# EAGLE design hermes v2 (EAGLE 7.7.0)
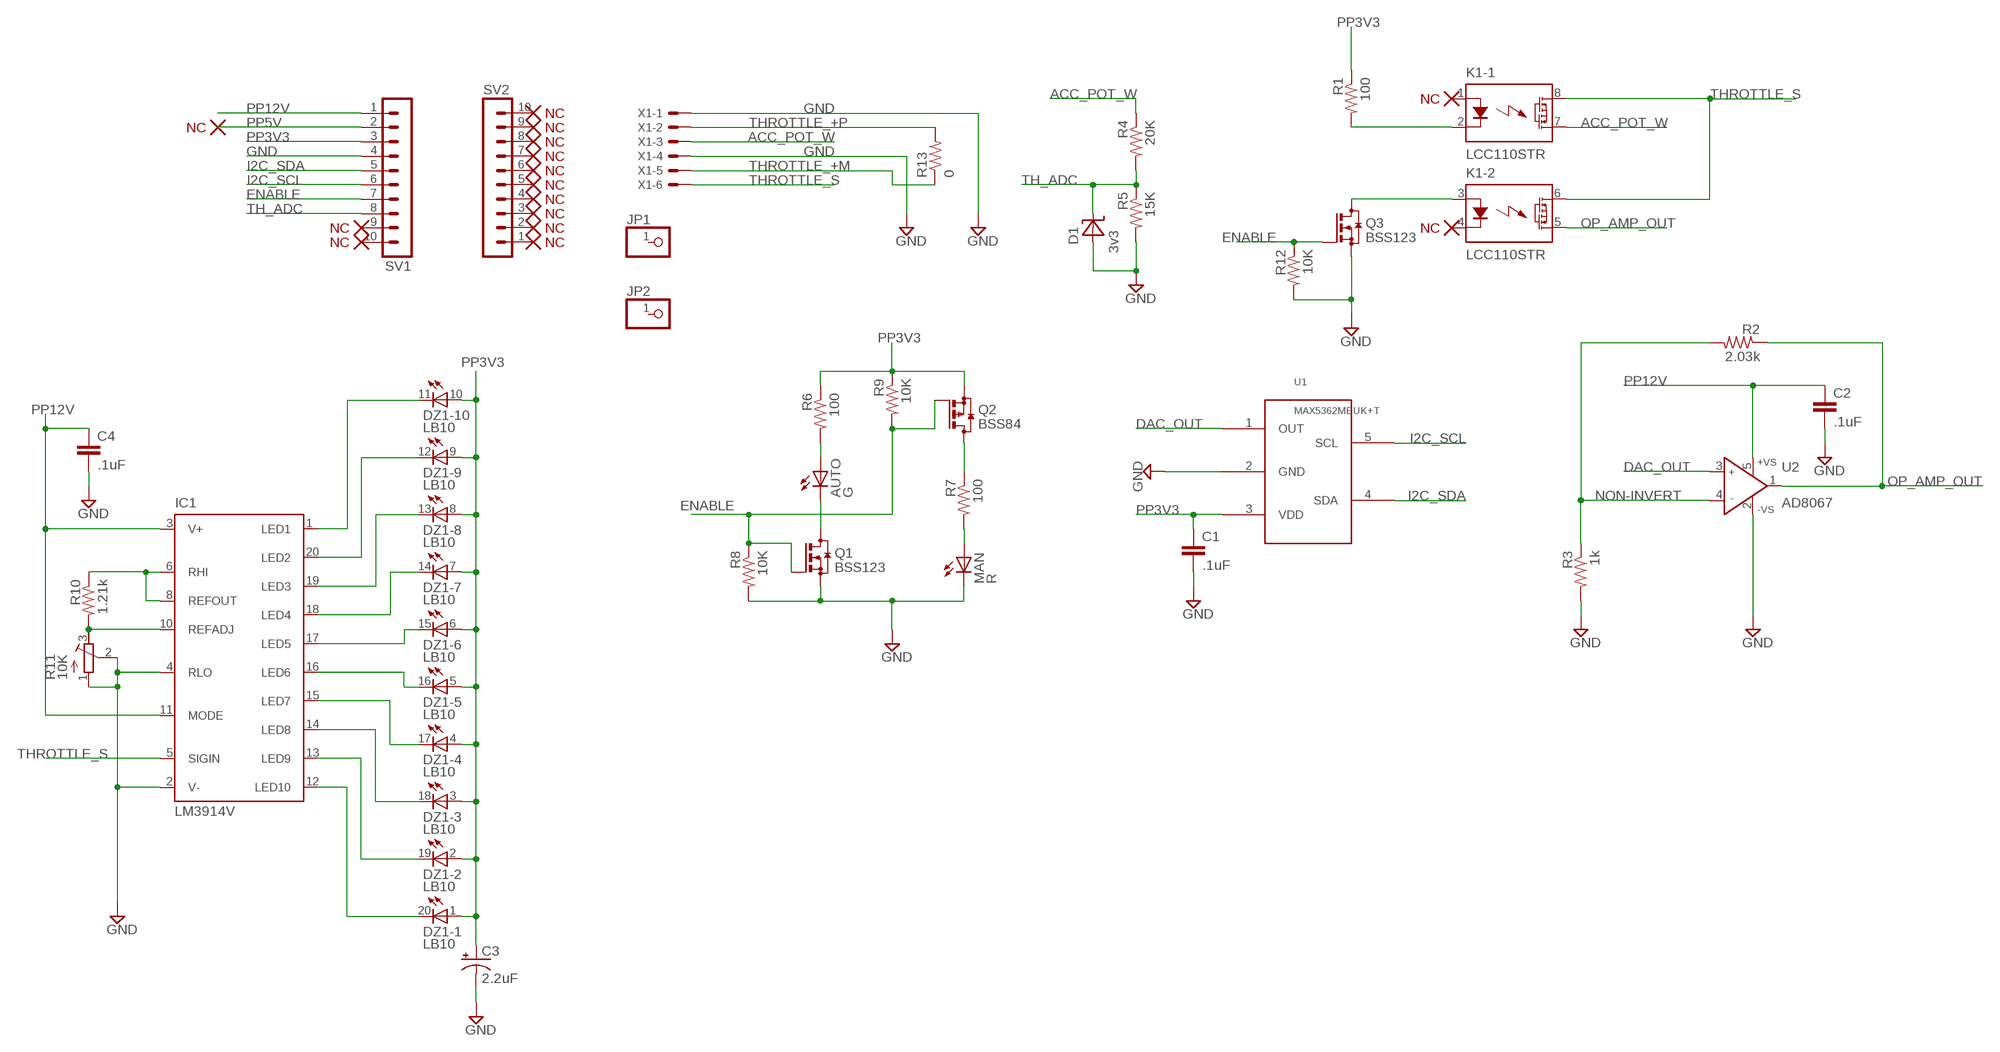
[diagram p0: schematic, sheet 1]

## Parts
AUTO  G  LED_ESML0603  [LED_SML0603]
C1  .1uF  CC0402  [C0402]
C2  .1uF  CC0402  [C0402]
C3  2.2uF  CPOL-USSMCA  [SMC_A]
C4  .1uF  CC0402  [C0402]
D1  3v3  ZENER  [SOD323_ST]
DZ1  LB10  [LB10]
IC1  LM3914V  [PLCC20S]
JP1  PINHD-1X1  [1X01]
JP2  PINHD-1X1  [1X01]
K1  LCC110STR  AQW654SMD  [DIL08SMD]
MAN  R  LED_ESML0603  [LED_SML0603]
Q1  BSS123  [SOT23]
Q2  BSS84  [SOT23]
Q3  BSS123  [SOT23]
R1  100  R-US_R0603  [R0603]
R2  2.03k  R-US_R0603  [R0603]
R3  1k  R-US_R0603  [R0603]
R4  20K  R-US_R0603  [R0603]
R5  15K  R-US_R0603  [R0603]
R6  100  R-US_R0603  [R0603]
R7  100  R-US_R0603  [R0603]
R8  10K  R-US_R0603  [R0603]
R9  10K  R-US_R0603  [R0603]
R10  1.21k  R-US_R0603  [R0603]
R11  10K  R-TRIMM5X  [RTRIM5X]
R12  10K  R-US_R0603  [R0603]
R13  0  R-US_R0402  [R0402]
SV1  MA10-1  [MA10-1]
SV2  MA10-1  [MA10-1]
U1  DAC  [SOT23-5]
U2  AD8067  [SOT23-5]
X1  22-23-2061  [22-23-2061]

## Nets
ACC_POT_W: K1.7(-1:D2) R4.1 X1.3
CONTROL_+: K1.2(-1:K) R1.2
CONTROL_-: K1.3(-2:A) Q3.3(D)
DAC_OUT: U1.1(OUT) U2.3(IN+)
ENABLE: Q1.1(G) Q2.1(G) Q3.1(G) R8.1 R9.2 R12.1 SV1.7
GND: C1.2 C2.2 C3.- C4.2 D1.A IC1.2(V-) IC1.4(RLO) MAN.C Q1.2(S) Q3.2(S) R3.2 R5.2 R8.2 R11.1(A) R11.2(S) R12.2 SV1.4 U1.2(GND) U2.2(-VS) X1.1 X1.4
I2C_SCL: SV1.6 U1.5(SCL)
I2C_SDA: SV1.5 U1.4(SDA)
N$1: DZ1.11(-10:C) IC1.1(LED1)
N$2: AUTO.C Q1.3(D)
N$3: MAN.A R7.2
N$4: AUTO.A R6.2
N$5: Q2.3(D) R7.1
N$6: DZ1.12(-9:C) IC1.20(LED2)
N$7: DZ1.13(-8:C) IC1.19(LED3)
N$8: DZ1.14(-7:C) IC1.18(LED4)
N$9: DZ1.15(-6:C) IC1.17(LED5)
N$10: DZ1.16(-5:C) IC1.16(LED6)
N$11: DZ1.17(-4:C) IC1.15(LED7)
N$12: DZ1.18(-3:C) IC1.14(LED8)
N$13: DZ1.19(-2:C) IC1.13(LED9)
N$14: DZ1.20(-1:C) IC1.12(LED10)
N$15: IC1.10(REFADJ) R10.2 R11.3(E)
N$16: IC1.6(RHI) IC1.8(REFOUT) R10.1
NON-INVERT: R2.2 R3.1 U2.4(IN-)
OP_AMP_OUT: K1.5(-2:D2) R2.1 U2.1(OUT)
PP3V3: C1.1 C3.+ DZ1.1(-1:A) DZ1.2(-2:A) DZ1.3(-3:A) DZ1.4(-4:A) DZ1.5(-5:A) DZ1.6(-6:A) DZ1.7(-7:A) DZ1.8(-8:A) DZ1.9(-9:A) DZ1.10(-10:A) Q2.2(S) R1.1 R6.1 R9.1 SV1.3 U1.3(VDD)
PP5V: SV1.2
PP12V: C2.1 C4.1 IC1.3(V+) IC1.11(MODE) SV1.1 U2.5(+VS)
TH_ADC: D1.C R4.2 R5.1 SV1.8
THROTTLE_+M: R13.1 X1.5
THROTTLE_+P: R13.2 X1.2
THROTTLE_S: IC1.5(SIGIN) K1.6(-2:D1) K1.8(-1:D1) X1.6
Unconnected: JP1.1 JP2.1 K1.1(-1:A) K1.4(-2:K) SV1.9 SV1.10 SV2.1 SV2.2 SV2.3 SV2.4 SV2.5 SV2.6 SV2.7 SV2.8 SV2.9 SV2.10

## Library data of the parts
AUTO MAN = eagle-ltspice:LED_E: LED Source: http://www.osram.convergy.de Source: www.luxeon.com Source: www.kingbright.com; SPICEMODEL: NONE; SPICEPREFIX: D; SPICETYPE: diode
C1 C2 C4 = eagle-ltspice:C: CAPACITOR, European symbol; SPICEMODEL: NONE; SPICEPREFIX: C
C3 = rcl:CPOL-US: POLARIZED CAPACITOR, American symbol; DIGI: 478-3119-2-ND
D1 = diode:ZENER
DZ1 = led:LB10: LED BLOCK 10-LED bar graph, DIL, Siemens
IC1 = national-semiconductor:LM391: Dot/Bar Display Driver Source: Data sheet LM3915 <http://www.national.com/ds/LM/LM3915.pdf> Data sheet LM3914 <http://www.national.com/ds/LM/LM3914.pdf>
JP1 JP2 = pinhead:PINHD-1X1: PIN HEADER
K1 = relay:AQW*: PhotoMOS Relay NAiS Source: http://www.mew-europe.com/.. pti_en.pdf; MF: AROMAT/ MATSUSHITA; MPN: AQW654; OC_FARNELL: unknown; OC_NEWARK: 98B6279
Q1 Q3 = transistor-small-signal:BSS123: N-CHANNEL MOS FET
Q2 = transistor-small-signal:BSS84: P-CHANNEL MOS FET
R1-R10 R12 = resistor:R-US_: RESISTOR, American symbol
R11 = rcl:R-TRIMM: Trimm resistor; DIGI: 490-2678-1-ND
R13 = rcl:R-US_: RESISTOR, American symbol
SV1 SV2 = con-lstb:MA10-1: PIN HEADER; OC_FARNELL: unknown; OC_NEWARK: unknown
U1 = DAC:DAC; DIGI: MAX5362MEUK+TCT-ND
U2 = analog-devices:AD8067: High Gain Bandwidth, Precision Fast FET(TM) Op Amp Source: http://www.analog.com/UploadedFiles/Data_Sheets/346131962AD8067_a.pdf; DIGI: 497-13051-1-ND; MF: ALTERA CORPORATION; MPN: AD8067ARTZ-REEL7; OC_FARNELL: 1464848; OC_NEWARK: 59K6326
X1 = con-molex:22-23-2061: .100" (2.54mm) Center Header - 6 Pin; MF: MOLEX; MPN: 22-23-2061; OC_FARNELL: 1462922; OC_NEWARK: 27C1933

## Board
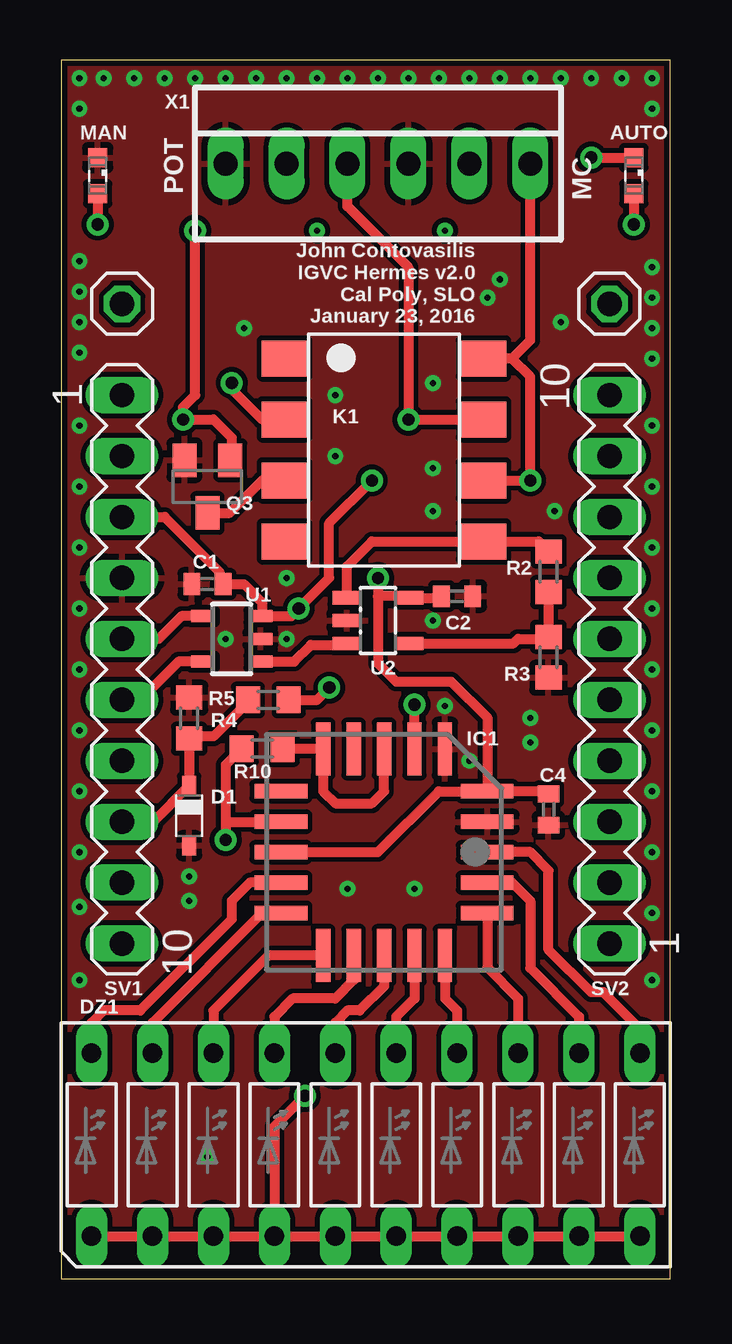
[diagram p1: board, top side]
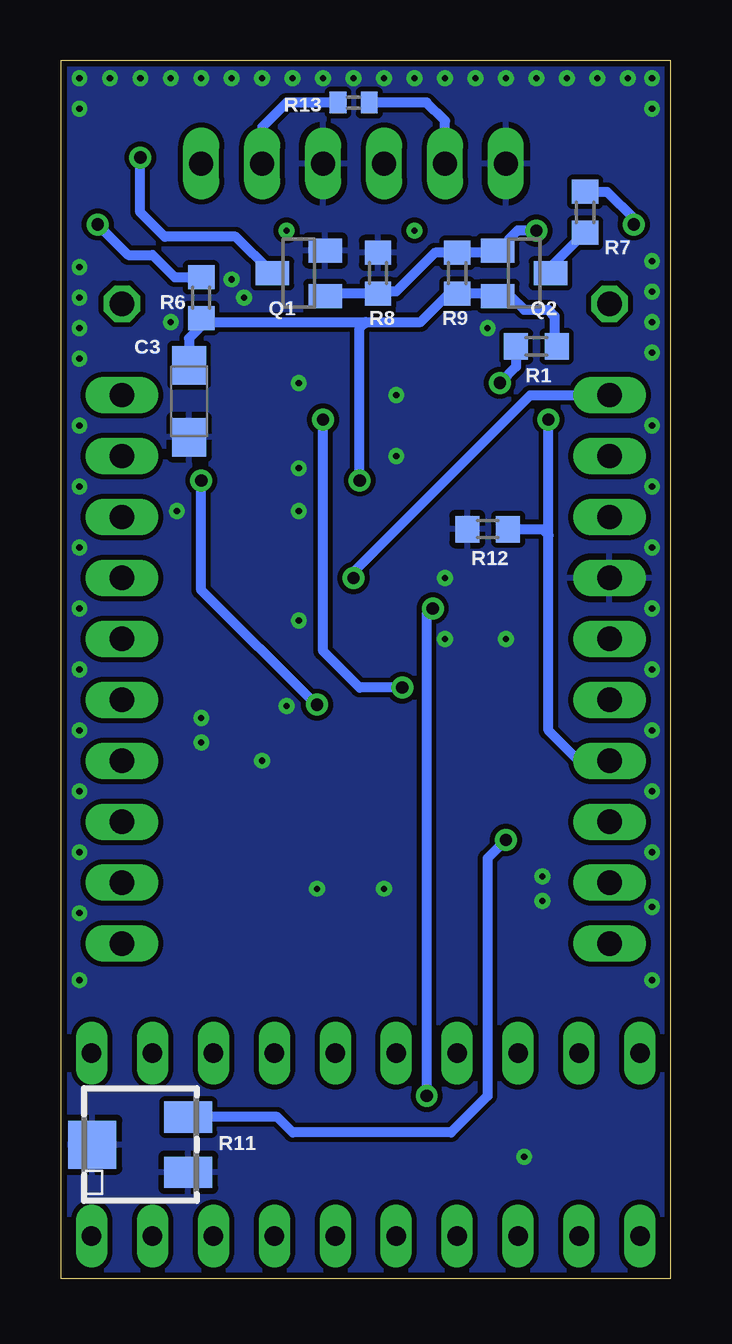
[diagram p2: board, bottom side, seen from below]

Size 25.4 x 50.8 mm. Coordinates in mm from the lower left corner, seen from the top.
Outline: 0,0 25.4,0 25.4,50.8 0,50.8 0,0
Copper layers (1*16): Top 0.035mm / dielectric 1.5mm / Bottom 0.035mm
Design rules "default *": minimum track width 10mil, minimum drill 10mil, track to track 8mil, track to pad 8mil, pad to pad 8mil, via to via 8mil, smd to smd 8mil, copper to edge 10mil, drill to drill 8mil, minimum pad ring 10mil, minimum via ring 8mil, stop-mask expansion 0mil, vias tented up to drill 0mil, thermal gap 10mil

### Footprints (pad centres in the part's own frame; a part is rotated, then mirrored left to right if it is on the bottom)
LED_SML0603 = smd 0.8 x 0.8: A 0.75,0; C -0.75,0
C0402 = smd 0.7 x 0.9: 1 -0.65,0; 2 0.65,0
SMC_A = smd 1.6 x 1.4: + -1.5,0; - 1.5,0
SOD323_ST = smd 0.8 x 0.6: A 1.25,0; C -1.25,0
LB10 = drill 0.813 long: 1 -11.43,-3.81; 2 -8.89,-3.81; 3 -6.35,-3.81; 4 -3.81,-3.81; 5 -1.27,-3.81; 6 1.27,-3.81; 7 3.81,-3.81; 8 6.35,-3.81; 9 8.89,-3.81; 10 11.43,-3.81; 11 11.43,3.81; 12 8.89,3.81; 13 6.35,3.81; 14 3.81,3.81; 15 1.27,3.81; 16 -1.27,3.81; 17 -3.81,3.81; 18 -6.35,3.81; 19 -8.89,3.81; 20 -11.43,3.81
PLCC20S = smd 0.6 x 2.2: 1 0,4.3; 2 -1.27,4.3; 3 -2.54,4.3; 9 -2.54,-4.3; 10 -1.27,-4.3; 11 0,-4.3; 12 1.27,-4.3; 13 2.54,-4.3; 19 2.54,4.3; 20 1.27,4.3 | smd 2.2 x 0.6: 4 -4.3,2.54; 5 -4.3,1.27; 6 -4.3,0; 7 -4.3,-1.27; 8 -4.3,-2.54; 14 4.3,-2.54; 15 4.3,-1.27; 16 4.3,0; 17 4.3,1.27; 18 4.3,2.54
1X01 = drill 1.016 octagon: 1 0,0
DIL08SMD = smd 1.5 x 1.9: 1 -3.81,-4.15; 2 -1.27,-4.15; 3 1.27,-4.15; 4 3.81,-4.15; 5 3.81,4.15; 6 1.27,4.15; 7 -1.27,4.15; 8 -3.81,4.15
SOT23 = smd 1 x 1.4: 1 -0.95,-1.1; 2 0.95,-1.1; 3 0,1.1
R0603 = smd 1 x 1.1: 1 -0.85,0; 2 0.85,0
RTRIM5X = smd 1.3 x 2: 1 -1.15,-2; 3 1.15,-2 | smd 2 x 2: 2 0,2
R0402 = smd 0.7 x 0.9: 1 -0.65,0; 2 0.65,0
MA10-1 = drill 1.016 long: 1 -11.43,0; 2 -8.89,0; 3 -6.35,0; 4 -3.81,0; 5 -1.27,0; 6 1.27,0; 7 3.81,0; 8 6.35,0; 9 8.89,0; 10 11.43,0
SOT23-5 = smd 0.5 x 1: 1 -0.95,-1.2; 2 0,-1.2; 3 0.95,-1.2; 4 0.95,1.2; 5 -0.95,1.2
SOT23-5' = smd 0.55 x 1.2: 1 -0.95,-1.3; 2 0,-1.3; 3 0.95,-1.3; 4 0.95,1.3; 5 -0.95,1.3
22-23-2061 = drill 1 long: 1 -6.35,0; 2 -3.81,0; 3 -1.27,0; 4 1.27,0; 5 3.81,0; 6 6.35,0

### Placement (x,y rotation side)
AUTO  23.88,45.97 270 top
C1  6.1,28.96 180 top
C2  16.51,28.45 0 top
C3  20.07,36.58 270 bottom
C4  20.32,19.56 270 top
D1  5.33,19.3 270 top
DZ1  12.7,5.59 0 top
IC1  13.46,17.78 270 top
JP1  22.86,40.64 0 top
JP2  2.54,40.64 0 top
K1  13.46,34.54 270 top
MAN  1.52,45.97 270 top
Q1  15.49,41.91 90 bottom
Q2  6.1,41.91 270 bottom
Q3  6.1,33.02 180 top
R1  5.59,38.86 180 bottom
R2  20.32,29.46 270 top
R3  20.32,25.91 270 top
R4  8.64,24.13 180 top
R5  5.33,23.37 90 top
R6  19.56,40.89 90 bottom
R7  3.56,44.45 90 bottom
R8  12.19,41.91 90 bottom
R9  8.89,41.91 90 bottom
R10  8.38,22.1 180 top
R11  22.1,5.59 90 bottom
R12  7.62,31.24 180 bottom
R13  13.21,49.02 0 bottom
SV1  2.54,25.4 270 top
SV2  22.86,25.4 90 top
U1  7.11,26.67 90 top
U2  AD8067  [SOT23-5']  13.21,27.43 270 top
X1  13.21,46.48 0 top

### Tracks (layer width: path | path; a pad name or v marks a point on that pad's centre or on a via)
ACC_POT_W  (via drill 0.51)
  Top 0.406: v11.18,24.64 10.67,24.13 R4.1 | K1.7 v14.48,35.81 14.48,42.16 11.94,44.7 X1.3
  Bottom 0.406: v11.18,24.64 12.95,24.64 14.48,26.16 v14.48,35.81
CONTROL_+  (via drill 0.51)
  Top 0.406: v7.11,37.34 7.11,37.08 8.38,35.81 K1.2
  Bottom 0.406: R1.2 6.44,38.01 v7.11,37.34
CONTROL_-
  Top 0.406: Q3.3 7.03,31.92 8.38,33.27 K1.3
DAC_OUT
  Top 0.406: U1.1 9.72,25.72 10.41,26.42 11.84,26.42 U2.3
ENABLE  (via drill 0.51)
  Top 0.406: v5.59,43.69 5.59,36.83 5.08,36.32 v5.08,35.81 6.35,35.81 7.11,35.05 7.11,34.19 Q3.1
  Bottom 0.406: Q1.1 14.29,41.06 R8.1 12.1,41.15 11.43,41.15 9.82,42.76 R9.2 7.3,42.76 Q2.1 6.37,43.69 v5.59,43.69 | SV1.7 3.81,21.59 5.08,22.86 5.08,30.99 | 5.08,30.99 v5.08,35.81 | R12.1 5.33,31.24 5.08,30.99
GND  (via drill 0.25)
  other vias: 11.94,16.26 14.73,16.26 17.02,21.59 16,23.88 0.76,35.56 0.76,33.02 0.76,30.48 0.76,27.94 0.76,25.4 0.76,22.86 0.76,20.32 0.76,17.78 0.76,15.49 0.76,12.45 24.64,35.56 24.64,33.02 24.64,30.48 24.64,27.94 24.64,25.4 24.64,22.86 24.64,20.32 24.64,17.78 24.64,15.24 24.64,12.45 0.76,38.61 0.76,39.88 0.76,41.15 0.76,42.42 0.76,48.77 0.76,50.04 1.78,50.04 3.05,50.04 4.32,50.04 5.59,50.04 6.86,50.04 8.13,50.04 9.4,50.04 10.67,50.04 11.94,50.04 13.21,50.04 14.48,50.04 15.75,50.04 17.02,50.04 18.29,50.04 19.56,50.04 20.83,50.04 22.1,50.04 23.37,50.04 24.64,50.04 24.64,48.77 24.64,42.16 24.64,40.89 24.64,39.62 24.64,38.35 15.49,27.43 19.56,23.37 19.56,22.35 5.33,16.76 5.33,15.75 9.4,26.67 6.86,26.67 9.4,29.21 11.43,36.83 11.43,34.29 15.49,33.78 15.49,32 15.49,37.34 7.62,39.62 18.29,41.66 17.78,40.89 20.83,39.88 20.57,32 6.1,5.08
  pour Top: 0,50.8 25.4,50.8 25.4,0 0,0
  pour Bottom: 0,50.8 0,0 25.4,0 25.4,50.8
I2C_SCL
  Top 0.406: U1.5 4.89,25.72 3.3,24.13 SV1.6
I2C_SDA
  Top 0.406: U1.4 5.01,27.62 4.06,26.67 SV1.5
N$1
  Top 0.406: DZ1.11 24.13,10.41 22.61,11.94 22.1,11.94 20.32,13.72 20.32,17.02 19.56,17.78 IC1.1
N$2  (via drill 0.51)
  Top 0.406: v22.1,46.74 22.11,46.72 AUTO.C
  Bottom 0.406: Q1.3 18.12,43.43 21.08,43.43 22.1,44.45 v22.1,46.74
N$3  (via drill 0.51)
  Top 0.406: MAN.A v1.52,43.94
  Bottom 0.406: R7.2 2.63,45.3 1.52,44.2 v1.52,43.94
N$4  (via drill 0.51)
  Top 0.406: AUTO.A v23.88,43.94
  Bottom 0.406: v23.88,43.94 22.61,42.67 21.59,42.67 20.66,41.74 R6.2
N$5
  Bottom 0.406: R7.1 5,42.16 Q2.3
N$6
  Top 0.406: IC1.20 18.8,16.51 19.56,15.75 19.56,12.95 21.59,10.92 DZ1.12
N$7
  Top 0.406: IC1.19 17.76,12.97 19.05,11.68 DZ1.13
N$8
  Top 0.406: IC1.18 16,11.68 16.51,11.18 DZ1.14
N$9
  Top 0.406: IC1.17 14.73,11.68 13.97,10.92 DZ1.15
N$10
  Top 0.406: IC1.16 13.46,12.19 12.45,11.18 11.94,11.18 11.43,10.67 DZ1.16
N$11
  Top 0.406: IC1.15 12.19,12.45 11.43,11.68 9.65,11.68 8.89,10.92 DZ1.17
N$12
  Top 0.406: IC1.14 8.65,13.48 6.35,11.18 DZ1.18
N$13
  Top 0.406: IC1.13 8.38,15.24 3.81,10.67 DZ1.19
N$14
  Top 0.406: IC1.12 7.87,16.51 7.11,15.75 7.11,14.99 3.3,11.18 1.78,11.18 1.27,10.67 DZ1.20
N$15  (via drill 0.51)
  Top 0.406: R10.2 6.86,21.42 6.86,19.05 | 6.86,19.05 IC1.10 | 6.86,19.05 v6.86,18.29
  Bottom 0.406: R11.3 16.39,6.74 15.75,6.1 9.14,6.1 7.62,7.62 7.62,17.53 v6.86,18.29
N$16
  Top 0.406: R10.1 10.9,22.1 IC1.8 10.92,20.32 11.43,19.81 12.95,19.81 13.46,20.32 IC1.6
N$17  (via drill 0.25)
  other vias: 16,43.69
N$18  (via drill 0.25)
  other vias: 10.67,43.69
NON-INVERT
  Top 0.406: R2.2 R3.1 20.23,26.67 19.05,26.67 18.86,26.48 U2.4
OP_AMP_OUT
  Top 0.406: U2.1 11.91,29.69 12.95,30.73 K1.5 19.9,30.73 R2.1
PP3V3  (via drill 0.51)
  Top 0.406: DZ1.1 DZ1.2 DZ1.3 DZ1.4 | DZ1.4 DZ1.5 DZ1.6 DZ1.7 DZ1.8 DZ1.9 DZ1.10 | SV1.3 4.32,31.75 6.6,29.46 6.6,29.1 C1.1 7.62,28.96 8.38,28.19 8.38,27.69 U1.3 9.59,27.62 v9.91,27.94 11.18,29.21 11.18,31.5 v12.95,33.27 | v10.16,7.62 8.89,6.35 DZ1.4
  Bottom 0.406: R6.1 19.39,39.88 | 19.39,39.88 12.7,39.88 | 12.7,39.88 10.41,39.88 9.23,41.06 R9.1 7.3,41.06 Q2.2 6.67,40.96 6.1,40.39 5.08,40.39 4.83,40.13 4.83,38.95 R1.1 | v9.91,27.94 10.16,27.69 v10.16,7.62 | v12.95,33.27 12.95,39.62 12.7,39.88 | 19.39,39.88 20.07,39.2 C3.+
PP12V  (via drill 0.51)
  Top 0.406: C2.1 15.79,28.38 U2.5 14.44,28.45 13.21,28.45 | v13.21,29.21 13.21,28.45 | 13.21,28.45 13.21,25.65 13.97,24.89 16.26,24.89 17.76,23.39 IC1.3 | IC1.11 13.21,17.78 15.75,20.32 IC1.3 | C4.1 20.21,20.32 IC1.3
  Bottom 0.406: v13.21,29.21 13.21,29.46 5.84,36.83 SV1.1
TH_ADC
  Top 0.406: SV1.8 3.83,19.05 D1.C R5.1 5.42,22.61 6.35,22.61 7.79,24.04 R4.2
THROTTLE_+M
  Bottom 0.406: R13.1 16,49.02 17.02,48.01 X1.5
THROTTLE_+P
  Bottom 0.406: X1.2 9.4,48.26 10.16,49.02 R13.2
THROTTLE_S  (via drill 0.51)
  Top 0.406: K1.6 v19.56,33.27 19.56,37.59 18.8,38.35 | IC1.5 v14.73,23.93 | 18.8,38.35 K1.8 | 18.8,38.35 19.56,39.12 X1.6
  Bottom 0.406: v19.56,33.27 19.56,28.7 14.78,23.93 v14.73,23.93

### Text on the board
tPlace: POT | MC
tNames: John Contovasilis / IGVC Hermes v2.0 / Cal Poly, SLO / January 23, 2016